# EAGLE design bln-000 (EAGLE 9.6.2)
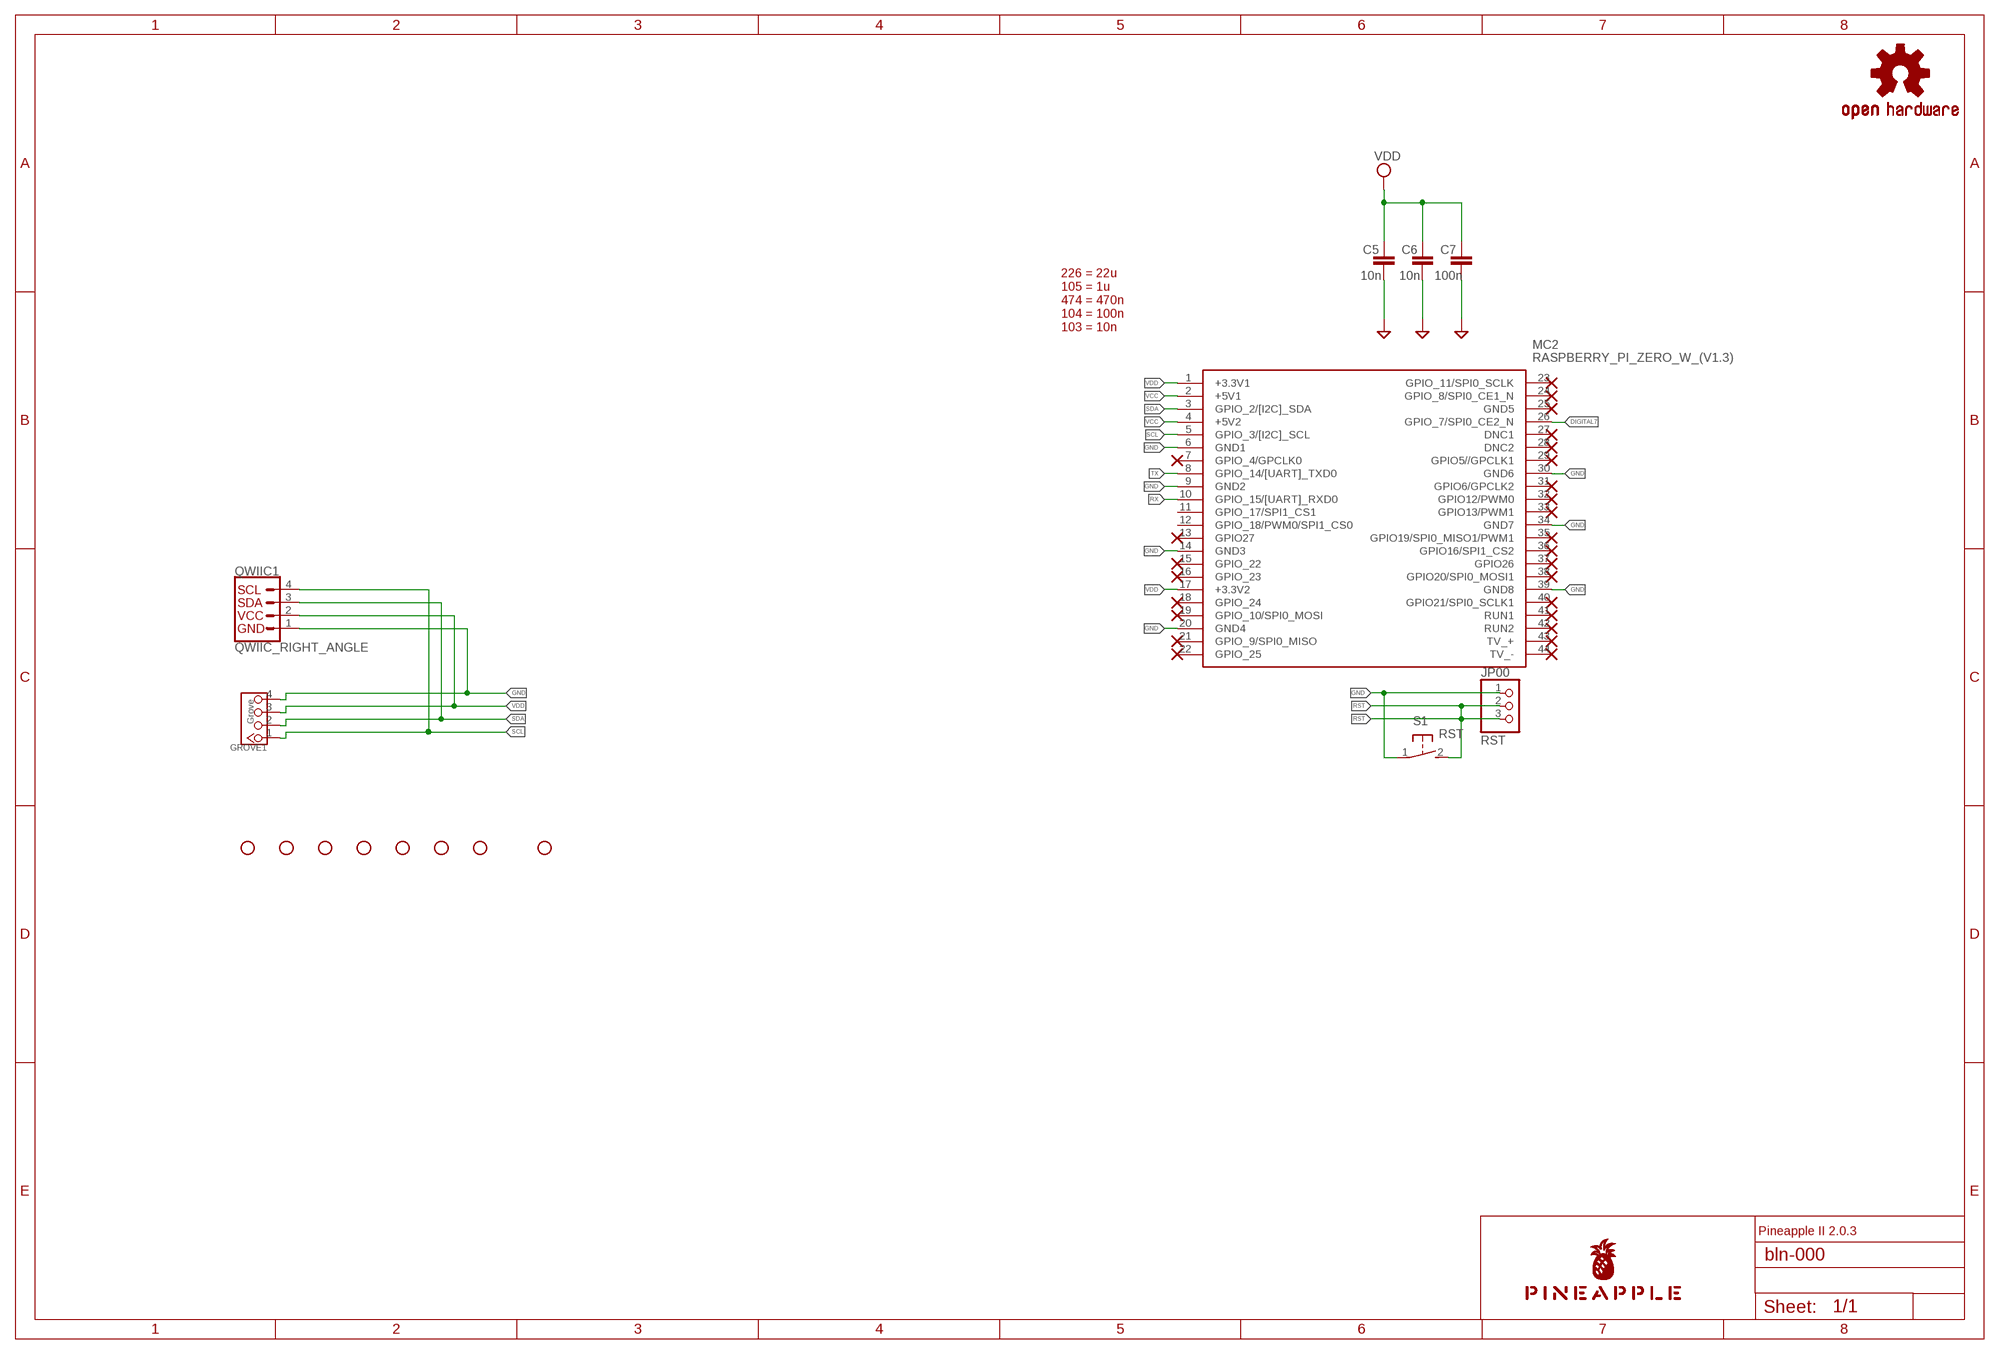
[diagram p0: schematic, sheet 1]

## Parts
C5  10n  C-EU025-024X044  [C025-024X044]
C6  10n  C-EU025-024X044  [C025-024X044]
C7  100n  C-EU025-024X044  [C025-024X044]
GROVE1  Grove  TWIG-4P-2.0'90D'  [4P-2.0-90D]
H1  STAND-OFF  [STAND-OFF]
H2  STAND-OFF  [STAND-OFF]
H3  STAND-OFF  [STAND-OFF]
H4  STAND-OFF  [STAND-OFF]
H5  STAND-OFF  [STAND-OFF]
H6  STAND-OFF  [STAND-OFF]
H7  STAND-OFF  [STAND-OFF]
H8  STAND-OFF  [STAND-OFF]
JP00  RST  PINHD-1X3  [1X03]
LOGO1  OSHW-LOGOS-COPPER  [OSHW-LOGO-S_COPPER]
MC2  RASPBERRY_PI_ZERO_W_(V1.3)  [RASPBERRYPIZEROWV13]
QWIIC1  QWIIC_RIGHT_ANGLE  QWIIC_CONNECTORJS-1MM  [JST04_1MM_RA]
S1  RST  31-XX  [B3F-31XX]
U$1  PINEAPPLE450_SILK  [PINEAPPLE450_SILK]

## Nets
DIGITAL7: MC2.26(GPIO_7/SPI0_CE2_N)
GND [gnd]: C5.2 C6.2 C7.2 GROVE1.4 JP00.1 MC2.6(GND1) MC2.9(GND2) MC2.14(GND3) MC2.20(GND4) MC2.30(GND6) MC2.34(GND7) MC2.39(GND8) QWIIC1.1 S1.1(P)
RST: JP00.2 JP00.3 S1.2(S)
RX: MC2.10(GPIO_15/[UART]_RXD0)
SCL: GROVE1.1 MC2.5(GPIO_3/[I2C]_SCL) QWIIC1.4
SDA: GROVE1.2 MC2.3(GPIO_2/[I2C]_SDA) QWIIC1.3
TX: MC2.8(GPIO_14/[UART]_TXD0)
VCC [power]: MC2.2(+5V1) MC2.4(+5V2)
VDD [power]: C5.1 C6.1 C7.1 GROVE1.3 MC2.1(+3.3V1) MC2.17(+3.3V2) QWIIC1.2
Unconnected: MC2.7(GPIO_4/GPCLK0) MC2.11(GPIO_17/SPI1_CS1) MC2.12(GPIO_18/PWM0/SPI1_CS0) MC2.13(GPIO27) MC2.15(GPIO_22) MC2.16(GPIO_23) MC2.18(GPIO_24) MC2.19(GPIO_10/SPI0_MOSI) MC2.21(GPIO_9/SPI0_MISO) MC2.22(GPIO_25) MC2.23(GPIO_11/SPI0_SCLK) MC2.24(GPIO_8/SPI0_CE1_N) MC2.25(GND5) MC2.27(DNC1) MC2.28(DNC2) MC2.29(GPIO5//GPCLK1) MC2.31(GPIO6/GPCLK2) MC2.32(GPIO12/PWM0) MC2.33(GPIO13/PWM1) MC2.35(GPIO19/SPI0_MISO1/PWM1) MC2.36(GPIO16/SPI1_CS2) MC2.37(GPIO26) MC2.38(GPIO20/SPI0_MOSI1) MC2.40(GPIO21/SPI0_SCLK1) MC2.41(RUN1) MC2.42(RUN2) MC2.43(TV_+) MC2.44(TV_-)

## Notes on the sheet
- 226 = 22u
  105 = 1u
  474 = 470n
  104 = 100n
  103 = 10n
- Pineapple II 2.0.3

## Library data of the parts
C5-C7 = resistor:C-EU: CAPACITOR, European symbol
GROVE1 = Connector:TWIG-4P-2.0
H1-H8 = SparkFun-Hardware:STAND-OFF: Stand Off Drill holes for mechanically mounting via screws, standoffs, etc. Note: Use the keepout ring to avoid running the screw head into surrounding components. Variant Overviews STAND-OFF - Mechanical footprint for a #4 phillips button head screw. STAND-OFF-TIGHT - Mechanical footprint for a #4 phillips button head screw, Example SparkFun Products Screw - Phillips Head (1/4", 4-40, 10 pack) <https://www.sparkfun.com/products/10453> (PRT-10453) Screw - Phillips Head (1/2", 4-40, 10 pack) <https://www.sparkfun.com/products/10452> (PRT-10452) Screw - Phillips Head (3/4", 4-40, 10 pack) <https://www.sparkfun.com/products/10451> (PRT-10451) Screw - Phillips Head (1", 4-40, 10 pack) <https://www.sparkfun.com/products/10450> (PRT-10450)
JP00 = pinhead:PINHD-1X3: PIN HEADER
LOGO1 = SparkFun-Aesthetics:OSHW-LOGO: Open-Source Hardware (OSHW) Logo This logo indicates the piece of hardware it is found on incorporates a OSHW license and/or adheres to the definition of open source hardware found here: http://freedomdefined.org/OSHW
MC2 = Raspberry_Pi_Zero_W_(v1.3):RASPBERRY_PI_ZERO_W_(V1.3): Raspberry Pi Zero W (v1.3) Single-board Computers Source: Datasheet <https://cdn.sparkfun.com/assets/learn_tutorials/6/7/6/PiZero_1.pdf>; ARROW_PART_NUMBER: Raspberry Pi Zero W (v1.3); DESCRIPTION: Raspberry Pi Zero W (v1.3) Single-board Computers; HEIGHT: mm; MANUFACTURER_NAME: RASPBERRY-PI; MANUFACTURER_PART_NUMBER: Raspberry Pi Zero W (v1.3)
QWIIC1 = SparkFun-Connectors:QWIIC_CONNECTOR: SparkFun I2C Standard Qwiic Connector An SMD 1mm pitch JST connector makes it easy and quick (get it? Qwiic?) to connect I2C devices to each other. The Qwiic system <http://www.sparkfun.com/qwiic> enables fast and solderless connection between popular platforms and various sensors and actuators. We carry 200mm <https://www.sparkfun.com/products/14204>, 100mm <https://www.sparkfun.com/products/14205>, 50mm <https://www.sparkfun.com/products/14206>, and breadboard friendly <https://www.sparkfun.com/products/14207> Qwiic cables. We also offer 10 pcs strips <https://www.sparkfun.com/products/14323> the SMD connectors.; PROD_ID: CONN-13694
S1 = switch-omron:31-XX: OMRON SWITCH; MPN: B3F-3100; OC_FARNELL: 959704; OC_NEWARK: 36M3582
U$1 = pineapple:PINEAPPLE450_SILK

## Net classes
0 default: width 0.152 mm, drill 0.152 mm, clearance 0.152 mm
1 gnd: width 0.305 mm, drill 0.152 mm, clearance 0.152 mm
2 power: width 0.508 mm, drill 0.152 mm, clearance 0.152 mm
3 analog: width 0.305 mm, drill 0.152 mm, clearance 0.152 mm
4 superpower: width 1.016 mm, drill 0.152 mm, clearance 0.152 mm

## Board
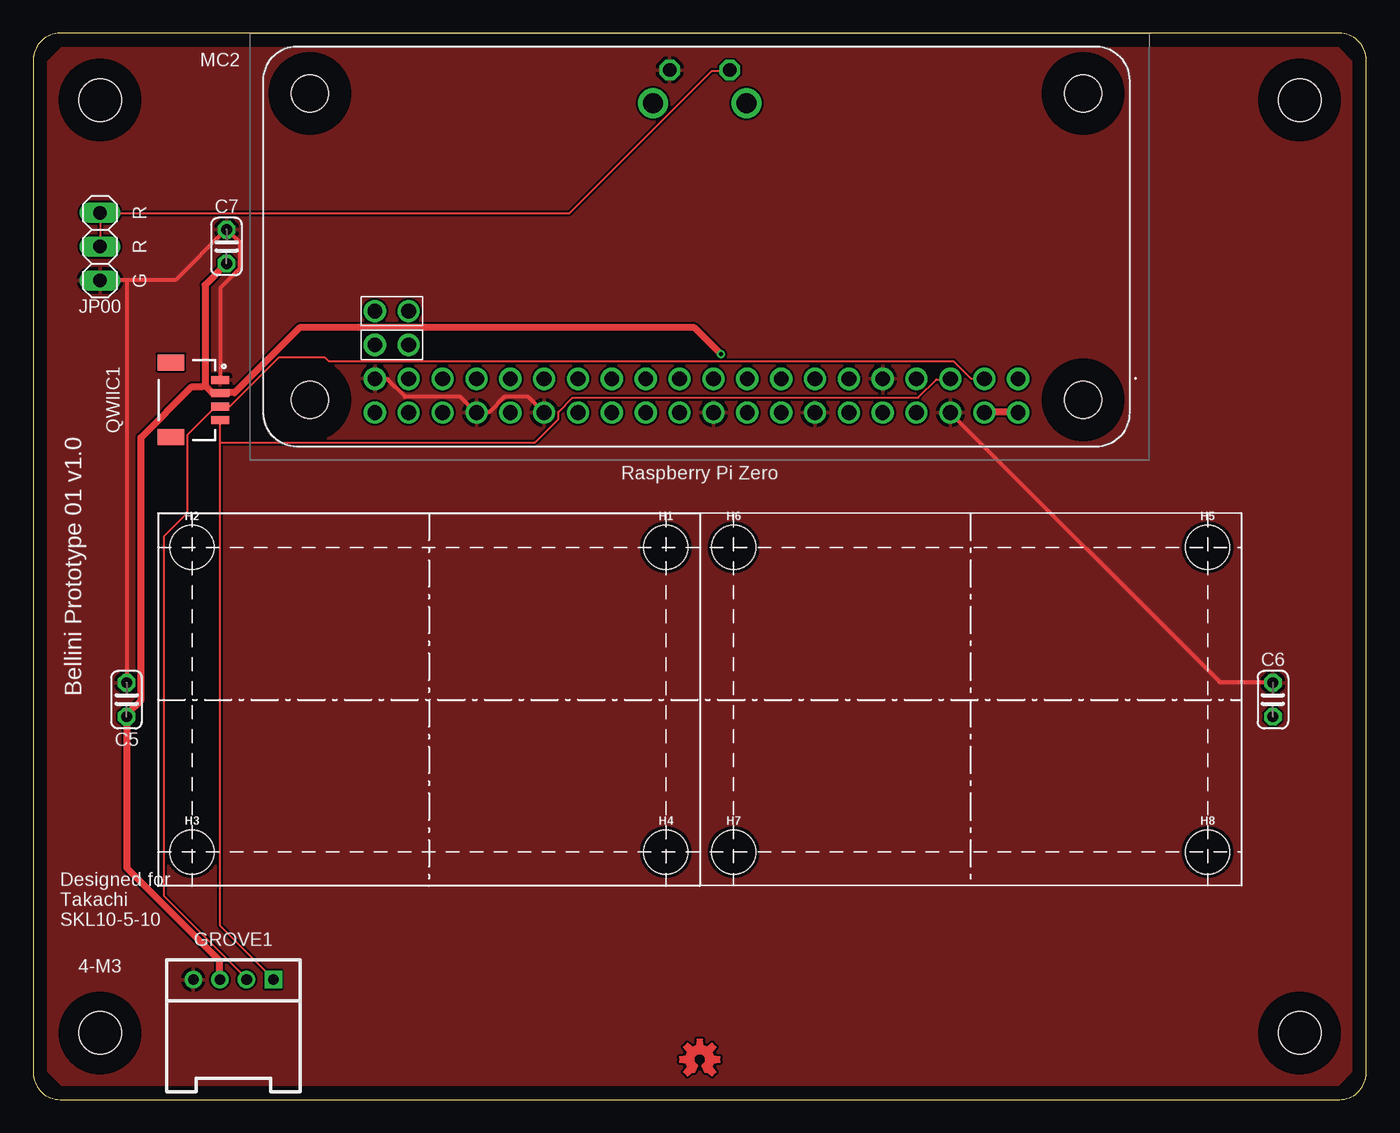
[diagram p1: board, top side]
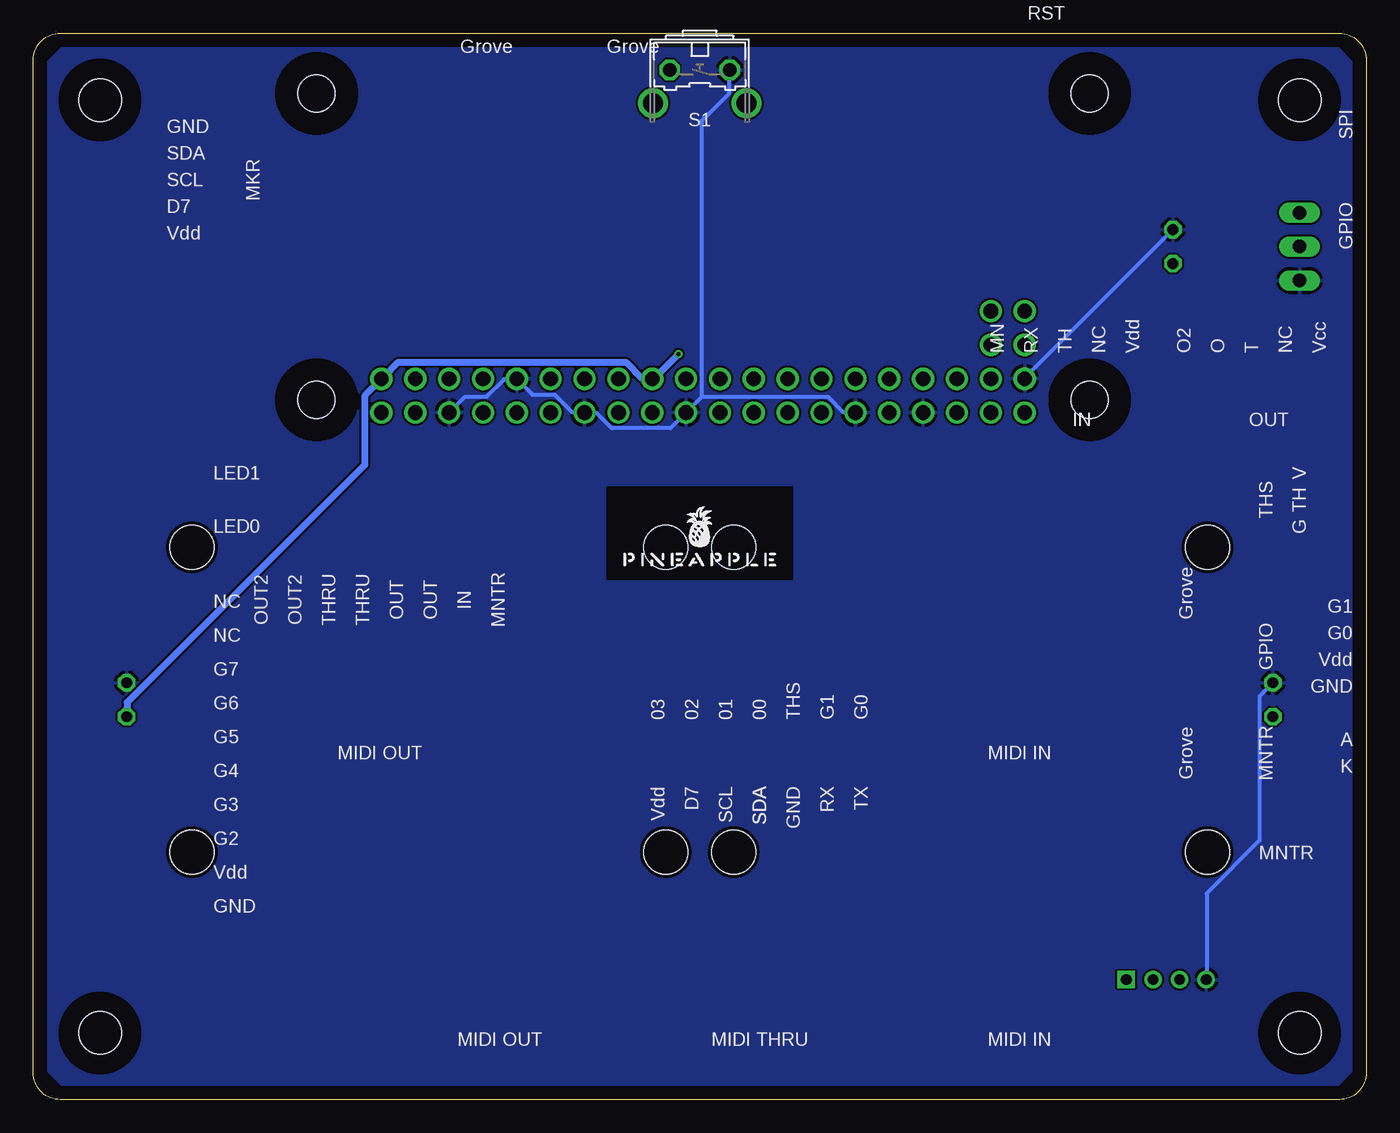
[diagram p2: board, bottom side, seen from below]

Size 100 x 80 mm. Coordinates in mm from the lower left corner, seen from the top.
Outline: 98,80 2,80 arc90 0,78 0,2 arc90 2,0 98,0 arc90 100,2 100,78 arc90 98,80
Copper layers (1*16): Top 0.035mm / dielectric 1.5mm / Bottom 0.035mm
Design rules "SeeedStudio_2layer_DRU_no_angle_20140221": minimum track width 6mil, minimum drill 12mil, track to track 6mil, track to pad 6mil, pad to pad 6mil, via to via 6mil, smd to smd 0mil, copper to edge 10mil, drill to drill 10mil, minimum pad ring 10mil, minimum via ring 6mil, stop-mask expansion 2mil, vias tented up to drill 100mil, thermal gap 10mil
Holes 3.2 mm at 95,75 5,75 5,5 95,5
tRestrict: area 2,72 to 8,78; area 92,72 to 98,78; area 2,2 to 8,8; area 92,2 to 98,8; area 0,79 to 100,80; area 99,0 to 100,80; area 0,0 to 100,1; area 0,0 to 1,80; area 1,1 to 2,2; area 1,78 to 2,79; area 98,78 to 99,79; area 98,1 to 99,2; 4 more areas
bRestrict: area 2,2 to 8,8; area 92,2 to 98,8; area 92,72 to 98,78; area 2,72 to 8,78; area 99,0 to 100,80; area 0,79 to 100,80; area 0,0 to 1,80; area 0,0 to 100,1; area 1,78 to 2,79; area 98,78 to 99,79; area 98,1 to 99,2; area 1,1 to 2,2; 5 more areas

### Footprints (pad centres in the part's own frame; a part is rotated, then mirrored left to right if it is on the bottom)
C025-024X044 = drill 0.813 octagon: 1 -1.27,0; 2 1.27,0
4P-2.0-90D = drill 0.8 pad 1.27 square: 1 -3,0 | drill 0.8 pad 1.27: 2 -1,0; 3 1,0; 4 3,0
STAND-OFF = hole 3.302: 0,0
1X03 = drill 1.016 long: 1 -2.54,0; 2 0,0; 3 2.54,0
RASPBERRYPIZEROWV13 = drill 1.11: 1 -23.885,9.92; 2 -23.885,12.46; 3 -21.345,9.92; 4 -21.345,12.46; 5 -18.805,9.92; 6 -18.805,12.46; 7 -16.265,9.92; 8 -16.265,12.46; 9 -13.725,9.92; 10 -13.725,12.46; 11 -11.185,9.92; 12 -11.185,12.46; 13 -8.645,9.92; 14 -8.645,12.46; 15 -6.105,9.92; 16 -6.105,12.46; 17 -3.565,9.92; 18 -3.565,12.46; 19 -1.025,9.92; 20 -1.025,12.46; 21 1.515,9.92; 22 1.515,12.46; 23 4.055,9.92; 24 4.055,12.46; 25 6.595,9.92; 26 6.595,12.46; 27 9.135,9.92; 28 9.135,12.46; 29 11.675,9.92; 30 11.675,12.46; 31 14.215,9.92; 32 14.215,12.46; 33 16.755,9.92; 34 16.755,12.46; 35 19.295,9.92; 36 19.295,12.46; 37 21.835,9.92; 38 21.835,12.46; 39 24.375,9.92; 40 24.375,12.46; 41 24.375,7.38; 42 21.835,7.38; 43 21.835,4.84; 44 24.375,4.84 | hole 2.8: -28.755,11.5; -28.755,-11.5; 29.245,-11.5; 29.245,11.5
JST04_1MM_RA = smd 0.6 x 1.35: 1 -1.5,0; 2 -0.5,0; 3 0.5,0; 4 1.5,0 | smd 1.2 x 2: NC1 2.8,-3.675; NC2 -2.8,-3.675
B3F-31XX = drill 1.016 octagon: 1 -2.261,-1.245; 2 2.261,-1.245 | drill 1.499 pad 2.159: 3 -3.505,1.245; 4 3.505,1.245

### Placement (x,y rotation side)
C5  7,30 90 top
C6  93,30 90 top
C7  14.5,64 90 top
GROVE1  15,9 180 top
H1  47.46,41.43 0 top
H2  11.9,41.43 0 top
H3  11.9,18.57 0 top
H4  47.46,18.57 0 top
H5  88.1,41.43 0 top
H6  52.54,41.43 0 top
H7  52.54,18.57 0 top
H8  88.1,18.57 0 top
JP00  5,64 90 top
LOGO1  50,3 0 top
MC2  50,64 180 top
QWIIC1  14,52.5 270 top
S1  50,76 180 bottom
U$1  50,40 0 bottom

### Tracks (layer width: path | path; a pad name or v marks a point on that pad's centre or on a via)
GND
  Top 0.305: C6.2 92.96,31.32 89,31.32 68.81,51.51 MC2.6 | QWIIC1.1 14.02,54.03 14.02,60.88 15.47,62.33 15.47,64.31 14.55,65.23 C7.2 14.4,65.23 10.67,61.49 7.01,61.49 | 7.01,61.49 5.03,61.49 JP00.1 | MC2.30 38.25,51.59 37.11,52.73 35.36,52.73 34.21,51.59 33.3,51.59 MC2.34 33.15,51.59 32,52.73 27.89,52.73 26.59,54.03 25.68,54.03 MC2.39 | 7.01,61.49 7.01,31.32 C5.2
  Bottom 0.305: MC2.6 68.73,51.59 67.59,52.73 65.99,52.73 64.69,54.03 63.86,54.03 MC2.9 63.7,54.03 62.56,52.88 60.88,52.88 59.59,51.59 58.67,51.59 MC2.14 58.52,51.51 57.76,51.51 56.62,50.37 52.2,50.37 51.13,51.44 MC2.20 50.98,51.59 49.84,52.73 | GROVE1.4 11.96,9.07 11.96,15.47 8,19.43 8,30.25 7.01,31.24 C5.2 | 49.84,52.73 49.84,73.46 47.78,75.51 47.78,77.19 S1.1 | 49.84,52.73 40.39,52.73 39.24,51.59 38.33,51.59 MC2.30 | C7.2 14.55,65.23 25.68,54.1 MC2.39
  pour Top: -2,-2 102,-2 102,82 -2,82
  pour Bottom: -4,-4 104,-4 104,84 -4,84
RST
  Top 0.152: JP00.2 5.03,64.01 5.03,66.52 JP00.3 5.11,66.52 40.23,66.52 50.9,77.19 52.2,77.19 S1.2
SCL
  Top 0.152: 14.02,49.3 14.02,13.03 17.98,9.07 GROVE1.1 | 14.02,49.3 14.02,50.98 QWIIC1.4 | 14.02,49.3 37.64,49.3 39.4,51.05 39.4,51.59 40.46,52.65 66.37,52.65 67.74,54.03 68.73,54.03 MC2.5
SDA
  Top 0.152: GROVE1.2 16,9.07 9.83,15.24 9.83,42.29 11.58,44.04 11.58,49.91 13.64,51.97 13.95,51.97 QWIIC1.3 14.02,52.05 14.78,52.05 18.44,55.7 21.87,55.7 22.17,55.4 69.04,55.4 70.33,54.1 71.32,54.1 MC2.3
VCC
  Top 0.508: MC2.4 71.4,51.59 73.84,51.59 MC2.2
VDD  (via drill 0.3)
  Top 0.508: 12.88,53.57 13.41,53.03 13.95,53.03 QWIIC1.2 14.25,53.03 15.09,53.03 19.96,57.91 49.61,57.91 v51.59,55.93 | 12.88,53.57 12.88,61.11 14.48,62.71 C7.1 | GROVE1.3 13.95,9.07 13.95,10.44 7.01,17.37 C5.1 7.09,28.96 8.08,29.95 8.08,49.68 11.89,53.49 12.65,53.49 12.88,53.57
  Bottom 0.508: C6.1 92.96,28.8 92.96,29.79 75.13,47.62 75.13,52.81 73.91,54.03 MC2.1 73.69,54.25 72.62,55.32 55.55,55.32 54.33,54.1 53.57,54.1 MC2.17 53.34,54.18 v51.59,55.93

### Text on the board
tNames: R | R | G | Raspberry Pi Zero | Bellini Prototype 01 v1.0 | Designed for / Takachi / SKL10-5-10 | 4-M3
bNames: SCL | SDA | Vdd | GND | SCL | SDA | Vdd | GND | RST | Grove | Grove | SPI | GND | SDA | MKR | SCL | D7 | GPIO | Vdd | Vcc | NC | T | O | O2 | Vdd | NC | TH | RX | MN | OUT | IN | V | LED1 | TH | THS | G | LED0 | Grove | MNTR | IN | OUT | OUT | THRU | THRU | OUT2 | OUT2 | G1 | NC | G0 | NC | GPIO | Vdd | G7 | GND | G6 | G0 | G1 | THS | 00 | 01 | 02 | 03 | A | G5 | MNTR | Grove | MIDI IN | MIDI OUT | K | G4 | TX | RX | GND | SDA | SDA | SCL | D7 | Vdd | G3 | G2 | MNTR | Vdd | GND | MIDI IN | MIDI THRU | MIDI OUT